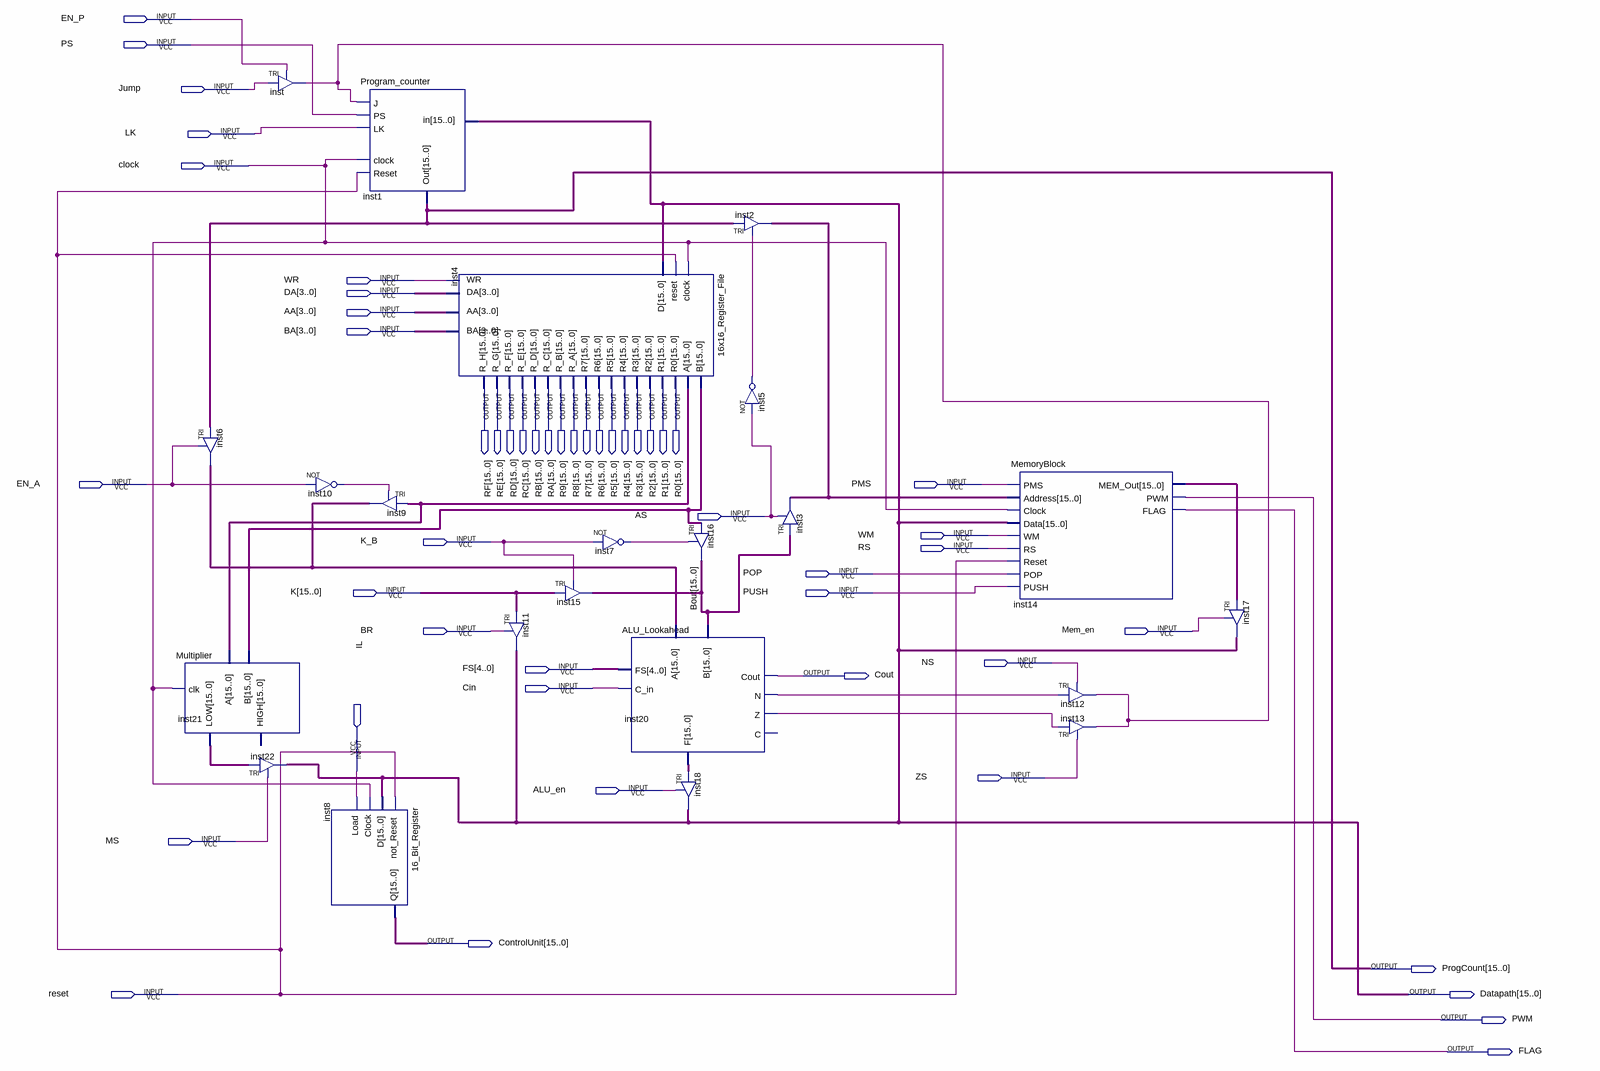
[diagram p0: schematic sheet]
// Quartus schematic Datapath.bdf as structural Verilog: 22 symbols, 50 pins
module Datapath (
  input  EN_P,
  input  PS,
  input  Jump,
  input  LK,
  input  clock,
  input  WR,
  input  [3:0] DA,
  input  [3:0] AA,
  input  [3:0] BA,
  input  EN_A,
  input  PMS,
  input  AS,
  input  WM,
  input  K_B,
  input  RS,
  input  POP,
  input  [15:0] K,
  input  PUSH,
  input  BR,
  input  Mem_en,
  input  NS,
  input  [4:0] FS,
  input  Cin,
  input  IL,
  input  ZS,
  input  ALU_en,
  input  MS,
  input  reset,
  output [15:0] RF,
  output [15:0] RE,
  output [15:0] RD,
  output [15:0] RC,
  output [15:0] RB,
  output [15:0] RA,
  output [15:0] R9,
  output [15:0] R8,
  output [15:0] R7,
  output [15:0] R6,
  output [15:0] R5,
  output [15:0] R4,
  output [15:0] R3,
  output [15:0] R2,
  output [15:0] R1,
  output [15:0] R0,
  output Cout,
  output [15:0] ControlUnit,
  output [15:0] ProgCount,
  output [15:0] Datapath,
  output PWM,
  output FLAG
);

  wire inst5_out, inst7_out, inst10_out, inst20_n, inst20_z, inst_out;
  wire [15:0] Bout, inst2_out, inst4_a, inst4_b, inst6_out, inst14_mem_out, inst20_f, inst21_low;

  TRI inst6[15:0] (.IN(ProgCount), .OE(EN_A), .OUT(inst6_out));
  Multiplier inst21 (.A(inst4_a), .clk(clock), .B(inst4_b), .LOW(inst21_low));  // open: HIGH
  TRI inst22[15:0] (.IN(inst21_low), .OE(MS), .OUT(Datapath));
  TRI inst (.IN(Jump), .OE(EN_P), .OUT(inst_out));
  not inst10 (inst10_out, EN_A);
  \16_Bit_Register  inst8 (.not_Reset(reset), .D(Datapath), .Clock(clock), .Load(IL), .Q(ControlUnit));
  Program_counter inst1 (.J(inst_out), .in(Datapath), .LK(LK), .Reset(reset), .clock(clock), .PS(PS), .Out(ProgCount));
  TRI inst9[15:0] (.IN(inst4_a), .OE(inst10_out), .OUT(inst6_out));
  \16x16_Register_File  inst4 (
    .WR(WR), .clock(clock), .reset(reset), .D(Datapath), .DA(DA), .AA(AA), .BA(BA), .R0(R0), .R1(R1),
    .R2(R2), .R3(R3), .R4(R4), .R5(R5), .R6(R6), .R7(R7), .A(inst4_a), .B(inst4_b), .R_A(R8), .R_B(R9),
    .R_C(RA), .R_D(RB), .R_E(RC), .R_F(RD), .R_G(RE), .R_H(RF));
  TRI inst11[15:0] (.IN(K), .OE(BR), .OUT(Datapath));
  TRI inst15[15:0] (.IN(K), .OE(K_B), .OUT(Bout));
  not inst7 (inst7_out, K_B);
  ALU_Lookahead inst20 (
    .FS(FS), .A(inst6_out), .B(Bout), .C_in(Cin), .F(inst20_f), .N(inst20_n), .Z(inst20_z), .Cout(Cout));  // open: C
  TRI inst16[15:0] (.IN(inst4_b), .OE(inst7_out), .OUT(Bout));
  TRI inst18[15:0] (.IN(inst20_f), .OE(ALU_en), .OUT(Datapath));
  TRI inst2[15:0] (.IN(ProgCount), .OE(inst5_out), .OUT(inst2_out));
  not inst5 (inst5_out, AS);
  TRI inst3[15:0] (.IN(Bout), .OE(AS), .OUT(inst2_out));
  MemoryBlock inst14 (
    .PMS(PMS), .Address(inst2_out), .Clock(clock), .Data(Datapath), .WM(WM), .RS(RS), .Reset(reset),
    .POP(POP), .PUSH(PUSH), .MEM_Out(inst14_mem_out), .PWM(PWM), .FLAG(FLAG));
  TRI inst12 (.IN(inst20_n), .OE(NS), .OUT(inst_out));
  TRI inst13 (.IN(inst20_z), .OE(ZS), .OUT(inst_out));
  TRI inst17[15:0] (.IN(inst14_mem_out), .OE(Mem_en), .OUT(Datapath));
endmodule
